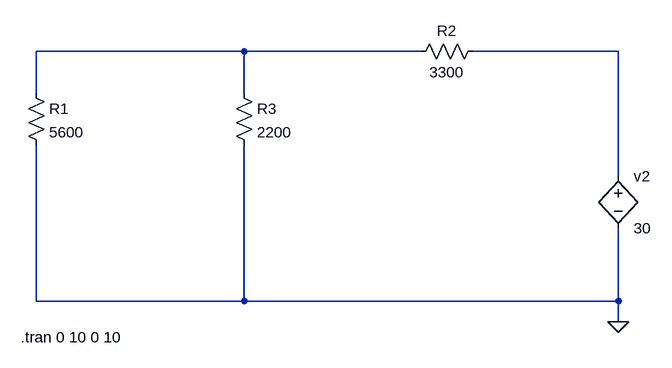
[diagram p0: schematic questão2v2.asc]
questão2v2.asc, the LTspice schematic file:
Version 4
SHEET 1 1060 680
WIRE 368 64 48 64
WIRE 640 64 368 64
WIRE 944 64 720 64
WIRE 48 128 48 64
WIRE 368 128 368 64
WIRE 944 256 944 64
WIRE 48 448 48 208
WIRE 368 448 368 208
WIRE 368 448 48 448
WIRE 944 448 944 336
WIRE 944 448 368 448
WIRE 944 480 944 448
FLAG 944 480 0
SYMBOL res 32 112 R0
SYMATTR InstName R1
SYMATTR Value 5600
SYMBOL res 352 112 R0
SYMATTR InstName R3
SYMATTR Value 2200
SYMBOL res 736 48 R90
WINDOW 0 0 56 VBottom 2
WINDOW 3 32 56 VTop 2
SYMATTR InstName R2
SYMATTR Value 3300
SYMBOL bv 944 240 R0
SYMATTR InstName v2
SYMATTR Value 30
SYMATTR Prefix v
TEXT 24 504 Left 2 !.tran 0 10 0 10

The netlist it stands for:
* questão2v2.asc
R1 N001 0 5600
R3 N001 0 2200
R2 N002 N001 3300
v2 N002 0 30
.tran 0 10 0 10
.backanno
.end